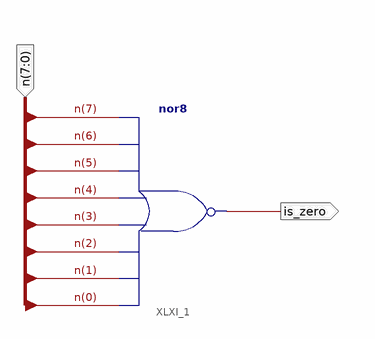
[diagram p0: schematic sheet 1]
// Xilinx ISE schematic test_zero.sch (spartan3e) as structural Verilog: 1 symbols, 2 ports
module test_zero (
  input  [7:0] n,
  output is_zero
);

  nor XLXI_1 (is_zero, n[0], n[1], n[2], n[3], n[4], n[5], n[6], n[7]);
endmodule
